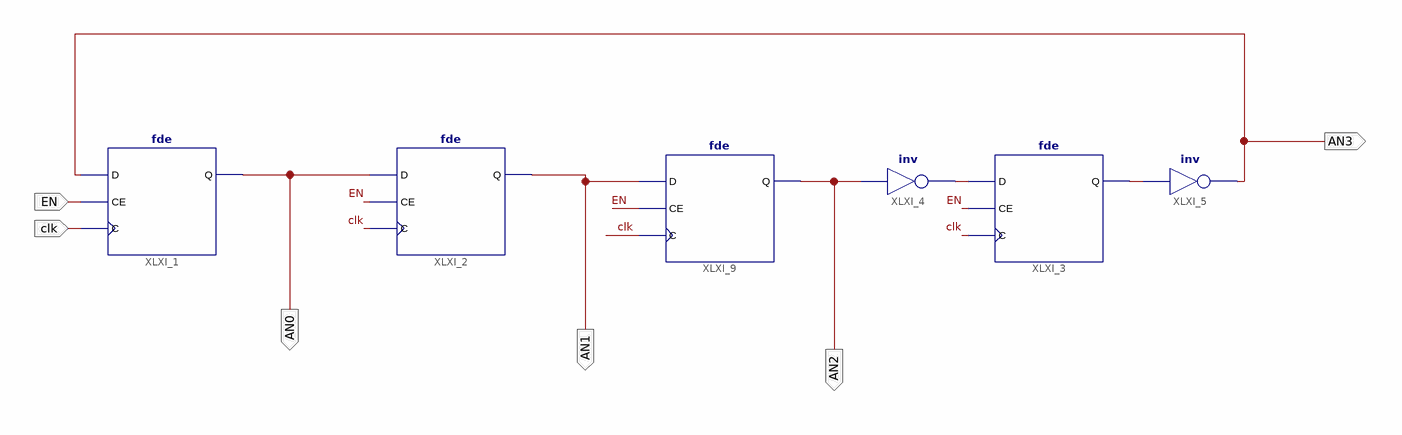
[diagram p0: schematic sheet 1]
// Xilinx ISE schematic RingCounter.sch (spartan3e) as structural Verilog: 6 symbols, 6 ports
module RingCounter (
  input  clk,
  input  EN,
  output AN3,
  output AN0,
  output AN1,
  output AN2
);

  wire XLXN_1, XLXN_2;

  fde XLXI_3 (.C(clk), .CE(EN), .D(XLXN_1), .Q(XLXN_2));
  not XLXI_4 (XLXN_1, AN2);
  not XLXI_5 (AN3, XLXN_2);
  fde XLXI_1 (.C(clk), .CE(EN), .D(AN3), .Q(AN0));
  fde XLXI_9 (.C(clk), .CE(EN), .D(AN1), .Q(AN2));
  fde XLXI_2 (.C(clk), .CE(EN), .D(AN0), .Q(AN1));
endmodule
